# Altium schematic sheet Analog_Buffer.SchDoc
size A
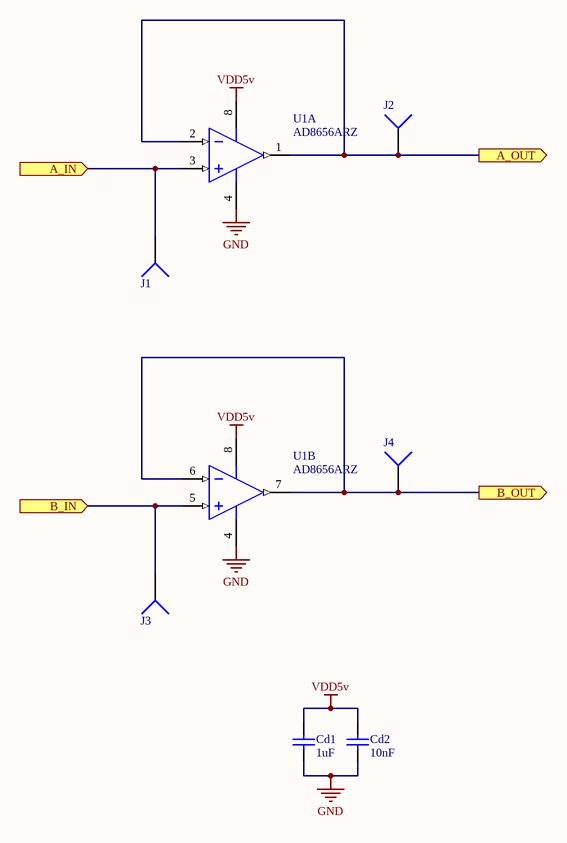
[diagram p0: Analog_Buffer.SchDoc]

## Parts
Cd1  value 1uF  [1608[0603]]  (hidden comment: Cap)
Cd2  value 10nF  [1608[0603]]  (hidden comment: Cap)
J1  Socket  [PIN1]  (value not drawn)
J2  Socket  [PIN1]  (value not drawn)
J3  Socket  [PIN1]  (value not drawn)
J4  Socket  [PIN1]  (value not drawn)
U1  AD8656ARZ  [ADI-R-8_N]  (parts A,B of 2)

## Ports
A_IN (in), A_OUT (out), B_IN (in), B_OUT (out)

## Nets
GND: Cd1.2 Cd2.2 U1.4(-V)
VDD5v: Cd1.1 Cd2.1 U1.8(+V)
A_IN: J1.1 U1.3(+IN_A) ; port A_IN
A_OUT: J2.1 U1.1(OUT_A) U1.2(-IN_A) ; port A_OUT
B_IN: J3.1 U1.5(+IN_B) ; port B_IN
B_OUT: J4.1 U1.6(-IN_B) U1.7(OUT_B) ; port B_OUT

## Library data of the parts
Cd1 Cd2 = Cap: Capacitor; Published: 8-Jun-2000; LatestRevisionDate: 17-Jul-2002; LatestRevisionNote: Re-released for DXP Platform.; PackageReference: RAD-0.3; Publisher: Altium Limited; PackageDescription: Radial Cap, Thru-Hole; 2 Leads; 0.3 in Pin Spacing; Digi-Key: 445-7534-1-ND
U1 = AD8656ARZ: Double Channel RRIO Operational Amplifier, 28 MHz BW, 11 V/us SR, Industrial, 8-pin SOIC (R-8), Tube; Generic Part Number: AD8656; Manufacturer: Analog Devices; Amplifiers Per Package: 2; Automotive Qualified: Yes; Input Bias Current: 1pA; Input Offset Voltage: 50uV; Iq/Amp: 4.5mA; Slew Rate: 11V/us; Small Signal Bandwidth: 28MHz; V Span Max: 5.5V; V Span Min: 2.7V; DatasheetVersion: Rev. B; PackageVersion: 060506-A; PackageReference: R-8; PackageDescription: 8-Pin Standard Small Outline Package, Body 3.9 x 4.9 mm, Pitch 1.27 mm; Supplier 1: Digi-Key; Supplier Part Number 1: AD8656ARZ-ND; Supplier 2: Farnell; Supplier Part Number 2: 1117887; Supplier 3: Newark; Supplier Part Number 3: 19M0993; Mounting Technology: Surface Mount; Code_JEDEC: MS-012-AA; PartNumber: AD8656ARZ; ComponentLink1Description: Manufacturer URL; ComponentLink1URL: http://www.analog.com/en/index.html; ComponentLink2Description: Datasheet; ComponentLink2URL: http://www.analog.com/static/imported-files/data_sheets/AD8655_8656.pdf; ComponentLink3Description: Package Specification; ComponentLink3URL: http://www.analog.com/static/imported-files/packages/PKG_PDF/SOIC_Narrow%20(R)/R_8.pdf
J1-J4 = Socket: LatestRevisionDate: 17-Jul-2002; LatestRevisionNote: Re-released for DXP Platform.; Publisher: Altium Limited